# EAGLE schematic 68030-TK-V09f (EAGLE 6.6.0)

## Sheet 1 of 3
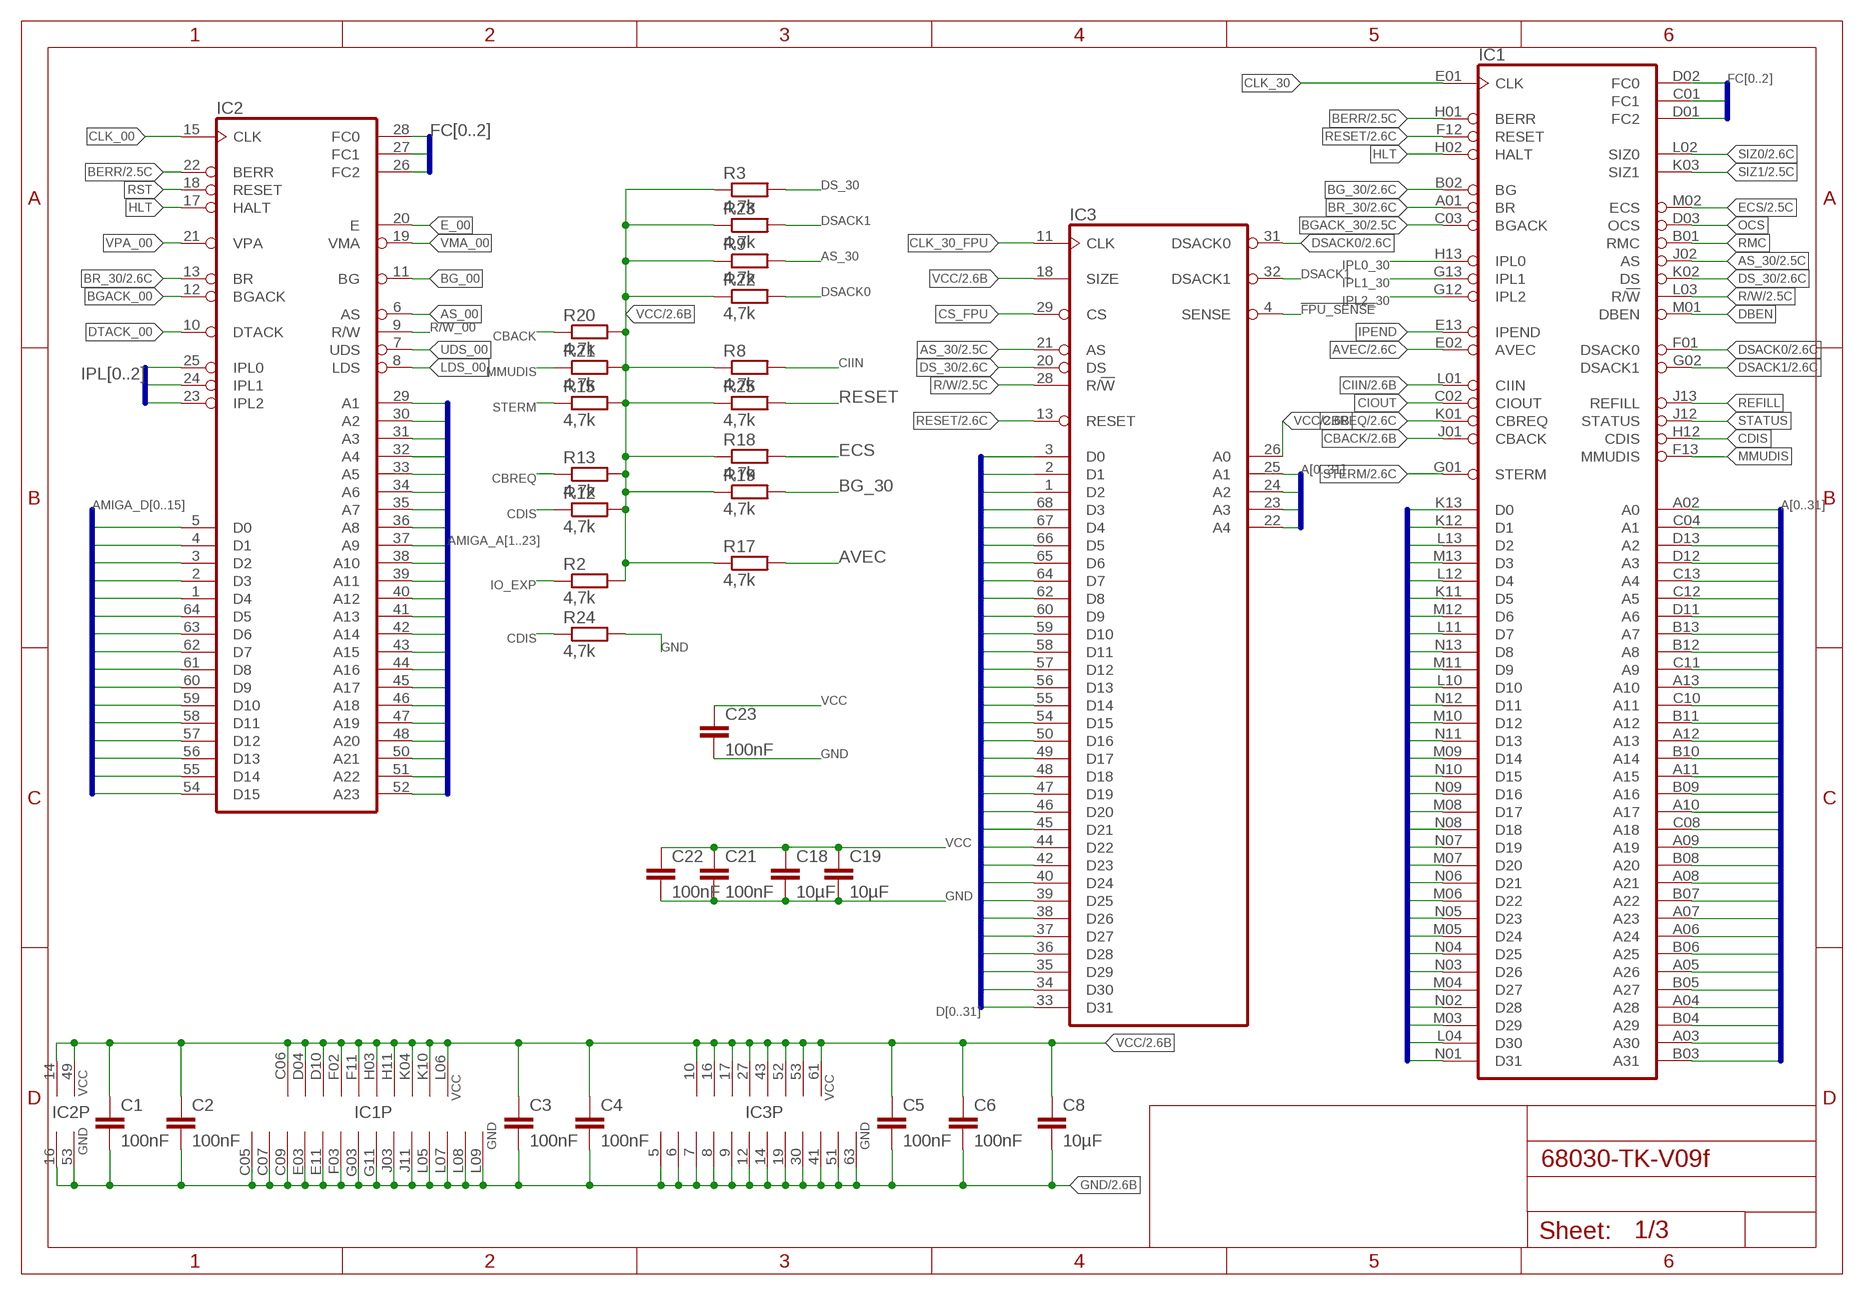
[diagram p0: schematic, sheet 1]

### Parts
C1  100nF  C-EUC0603K  [C0603K]
C2  100nF  C-EUC0603K  [C0603K]
C3  100nF  C-EUC0603K  [C0603K]
C4  100nF  C-EUC0603K  [C0603K]
C5  100nF  C-EUC0603K  [C0603K]
C6  100nF  C-EUC0603K  [C0603K]
C8  10µF  C-EUC1210  [C1210]
C18  10µF  C-EUC1210  [C1210]
C19  10µF  C-EUC1210  [C1210]
C21  100nF  C-EUC0603K  [C0603K]
C22  100nF  C-EUC0603K  [C0603K]
C23  100nF  C-EUC0603K  [C0603K]
IC1  MC68030RC  [MPGA128]
IC2  MC68000P  [DIL64]
IC3  MC68881FN  [PLCC68]
R2  4,7k  R-EU_R0603  [R0603]
R3  4,7k  R-EU_R0603  [R0603]
R8  4,7k  R-EU_R0603  [R0603]
R9  4,7k  R-EU_R0603  [R0603]
R12  4,7k  R-EU_R0603  [R0603]
R13  4,7k  R-EU_R0603  [R0603]
R15  4,7k  R-EU_R0603  [R0603]
R17  4,7k  R-EU_R0603  [R0603]
R18  4,7k  R-EU_R0603  [R0603]
R19  4,7k  R-EU_R0603  [R0603]
R20  4,7k  R-EU_R0603  [R0603]
R21  4,7k  R-EU_R0603  [R0603]
R22  4,7k  R-EU_R0603  [R0603]
R23  4,7k  R-EU_R0603  [R0603]
R24  4,7k  R-EU_R0603  [R0603]
R25  4,7k  R-EU_R0603  [R0603]

### Nets
!FPU_SENSE: IC3.4(SENSE) ; also sheet 2
A0: IC1.A02(A0) ; also sheet 2,3
A1: IC1.C04(A1) IC3.25(A1) ; also sheet 2,3
A2: IC1.D13(A2) IC3.24(A2) ; also sheet 2,3
A3: IC1.D12(A3) IC3.23(A3) ; also sheet 2,3
A4: IC1.C13(A4) IC3.22(A4) ; also sheet 2,3
A5: IC1.C12(A5) ; also sheet 2,3
A6: IC1.D11(A6) ; also sheet 2,3
A7: IC1.B13(A7) ; also sheet 2,3
A8: IC1.B12(A8) ; also sheet 2,3
A9: IC1.C11(A9) ; also sheet 2,3
A10: IC1.A13(A10) ; also sheet 2,3
A11: IC1.C10(A11) ; also sheet 2,3
A12: IC1.B11(A12) ; also sheet 2,3
A13: IC1.A12(A13) ; also sheet 2,3
A14: IC1.B10(A14) ; also sheet 2,3
A15: IC1.A11(A15) ; also sheet 2,3
A16: IC1.B09(A16) ; also sheet 2,3
A17: IC1.A10(A17) ; also sheet 2,3
A18: IC1.C08(A18) ; also sheet 2,3
A19: IC1.A09(A19) ; also sheet 2,3
A20: IC1.B08(A20) ; also sheet 2,3
A21: IC1.A08(A21) ; also sheet 2,3
A22: IC1.B07(A22) ; also sheet 2,3
A23: IC1.A07(A23) ; also sheet 2,3
A24: IC1.A06(A24) ; also sheet 2,3
A25: IC1.B06(A25) ; also sheet 2,3
A26: IC1.A05(A26) ; also sheet 2,3
A27: IC1.B05(A27) ; also sheet 2,3
A28: IC1.A04(A28) ; also sheet 2,3
A29: IC1.B04(A29) ; also sheet 2,3
A30: IC1.A03(A30) ; also sheet 2,3
A31: IC1.B03(A31) ; also sheet 2,3
AMIGA_A1: IC2.29(A1) ; also sheet 3
AMIGA_A2: IC2.30(A2) ; also sheet 3
AMIGA_A3: IC2.31(A3) ; also sheet 3
AMIGA_A4: IC2.32(A4) ; also sheet 3
AMIGA_A5: IC2.33(A5) ; also sheet 3
AMIGA_A6: IC2.34(A6) ; also sheet 3
AMIGA_A7: IC2.35(A7) ; also sheet 3
AMIGA_A8: IC2.36(A8) ; also sheet 3
AMIGA_A9: IC2.37(A9) ; also sheet 3
AMIGA_A10: IC2.38(A10) ; also sheet 3
AMIGA_A11: IC2.39(A11) ; also sheet 3
AMIGA_A12: IC2.40(A12) ; also sheet 3
AMIGA_A13: IC2.41(A13) ; also sheet 3
AMIGA_A14: IC2.42(A14) ; also sheet 3
AMIGA_A15: IC2.43(A15) ; also sheet 3
AMIGA_A16: IC2.44(A16) ; also sheet 3
AMIGA_A17: IC2.45(A17) ; also sheet 3
AMIGA_A18: IC2.46(A18) ; also sheet 3
AMIGA_A19: IC2.47(A19) ; also sheet 3
AMIGA_A20: IC2.48(A20) ; also sheet 3
AMIGA_A21: IC2.50(A21) ; also sheet 3
AMIGA_A22: IC2.51(A22) ; also sheet 3
AMIGA_A23: IC2.52(A23) ; also sheet 3
AMIGA_D0: IC2.5(D0) ; also sheet 3
AMIGA_D1: IC2.4(D1) ; also sheet 3
AMIGA_D2: IC2.3(D2) ; also sheet 3
AMIGA_D3: IC2.2(D3) ; also sheet 3
AMIGA_D4: IC2.1(D4) ; also sheet 3
AMIGA_D5: IC2.64(D5) ; also sheet 3
AMIGA_D6: IC2.63(D6) ; also sheet 3
AMIGA_D7: IC2.62(D7) ; also sheet 3
AMIGA_D8: IC2.61(D8) ; also sheet 3
AMIGA_D9: IC2.60(D9) ; also sheet 3
AMIGA_D10: IC2.59(D10) ; also sheet 3
AMIGA_D11: IC2.58(D11) ; also sheet 3
AMIGA_D12: IC2.57(D12) ; also sheet 3
AMIGA_D13: IC2.56(D13) ; also sheet 3
AMIGA_D14: IC2.55(D14) ; also sheet 3
AMIGA_D15: IC2.54(D15) ; also sheet 3
AS_00: IC2.6(AS) ; also sheet 2
AS_30: IC1.J02(AS) IC3.21(AS) R9.2 ; also sheet 2
AVEC: IC1.E02(AVEC) R17.2 ; also sheet 2
BERR: IC1.H01(BERR) IC2.22(BERR) ; also sheet 2
BG_00: IC2.11(BG) ; also sheet 2
BG_30: IC1.B02(BG) R19.2 ; also sheet 2
BGACK_00: IC2.12(BGACK) ; also sheet 2,3
BGACK_30: IC1.C03(BGACK) ; also sheet 2
BR_30: IC1.A01(BR) IC2.13(BR) ; also sheet 2
CBACK: IC1.J01(CBACK) R20.1 ; also sheet 2
CBREQ: IC1.K01(CBREQ) R13.1 ; also sheet 2
CDIS: IC1.H12(CDIS) R12.1 R24.1
CIIN: IC1.L01(CIIN) R8.2 ; also sheet 2
CIOUT: IC1.C02(CIOUT)
CLK_00: IC2.15(CLK) ; also sheet 2
CLK_30: IC1.E01(CLK) ; also sheet 2
CLK_30_FPU: IC3.11(CLK) ; also sheet 2
CS_FPU: IC3.29(CS) ; also sheet 2
D0: IC1.K13(D0) IC3.3(D0) ; also sheet 2,3
D1: IC1.K12(D1) IC3.2(D1) ; also sheet 2,3
D2: IC1.L13(D2) IC3.1(D2) ; also sheet 2,3
D3: IC1.M13(D3) IC3.68(D3) ; also sheet 2,3
D4: IC1.L12(D4) IC3.67(D4) ; also sheet 2,3
D5: IC1.K11(D5) IC3.66(D5) ; also sheet 2,3
D6: IC1.M12(D6) IC3.65(D6) ; also sheet 2,3
D7: IC1.L11(D7) IC3.64(D7) ; also sheet 2,3
D8: IC1.N13(D8) IC3.62(D8) ; also sheet 2,3
D9: IC1.M11(D9) IC3.60(D9) ; also sheet 2,3
D10: IC1.L10(D10) IC3.59(D10) ; also sheet 2,3
D11: IC1.N12(D11) IC3.58(D11) ; also sheet 2,3
D12: IC1.M10(D12) IC3.57(D12) ; also sheet 2,3
D13: IC1.N11(D13) IC3.56(D13) ; also sheet 2,3
D14: IC1.M09(D14) IC3.55(D14) ; also sheet 2,3
D15: IC1.N10(D15) IC3.54(D15) ; also sheet 2,3
D16: IC1.N09(D16) IC3.50(D16) ; also sheet 2,3
D17: IC1.M08(D17) IC3.49(D17) ; also sheet 2,3
D18: IC1.N08(D18) IC3.48(D18) ; also sheet 2,3
D19: IC1.N07(D19) IC3.47(D19) ; also sheet 2,3
D20: IC1.M07(D20) IC3.46(D20) ; also sheet 2,3
D21: IC1.N06(D21) IC3.45(D21) ; also sheet 2,3
D22: IC1.M06(D22) IC3.44(D22) ; also sheet 2,3
D23: IC1.N05(D23) IC3.42(D23) ; also sheet 2,3
D24: IC1.M05(D24) IC3.40(D24) ; also sheet 2,3
D25: IC1.N04(D25) IC3.39(D25) ; also sheet 2,3
D26: IC1.N03(D26) IC3.38(D26) ; also sheet 2,3
D27: IC1.M04(D27) IC3.37(D27) ; also sheet 2,3
D28: IC1.N02(D28) IC3.36(D28) ; also sheet 2,3
D29: IC1.M03(D29) IC3.35(D29) ; also sheet 2,3
D30: IC1.L04(D30) IC3.34(D30) ; also sheet 2,3
D31: IC1.N01(D31) IC3.33(D31) ; also sheet 2,3
DBEN: IC1.M01(DBEN)
DS_30: IC1.K02(DS) IC3.20(DS) R3.2 ; also sheet 2
DSACK0: IC1.F01(DSACK0) IC3.31(DSACK0) R22.2 ; also sheet 2
DSACK1: IC1.G02(DSACK1) IC3.32(DSACK1) R23.2 ; also sheet 2
DTACK_00: IC2.10(DTACK) ; also sheet 2
E_00: IC2.20(E) ; also sheet 2
ECS: IC1.M02(ECS) R18.2 ; also sheet 2
FC0: IC1.D02(FC0) IC2.28(FC0) ; also sheet 2
FC1: IC1.C01(FC1) IC2.27(FC1) ; also sheet 2
FC2: IC1.D01(FC2) IC2.26(FC2) ; also sheet 2
GND: C1.2 C2.2 C3.2 C4.2 C5.2 C6.2 C8.2 C18.2 C19.2 C21.2 C22.2 C23.2 IC1.C05(GND) IC1.C07(GND) IC1.C09(GND) IC1.E03(GND) IC1.E11(GND) IC1.F03(GND) IC1.G03(GND) IC1.G11(GND) IC1.J03(GND) IC1.J11(GND) IC1.L05(GND) IC1.L07(GND) IC1.L08(GND) IC1.L09(GND) IC2.16(GND) IC2.53(GND) IC3.5(GND) IC3.6(GND) IC3.7(GND) IC3.8(GND) IC3.9(GND) IC3.12(GND) IC3.14(GND) IC3.19(GND) IC3.30(GND) IC3.41(GND) IC3.51(GND) IC3.63(GND) R24.2 ; also sheet 2,3
HLT: IC1.H02(HALT) IC2.17(HALT)
IO_EXP: R2.1 ; also sheet 2
IPEND: IC1.E13(IPEND)
IPL0: IC2.25(IPL0) ; also sheet 2
IPL0_30: IC1.H13(IPL0) ; also sheet 2
IPL1: IC2.24(IPL1) ; also sheet 2
IPL1_30: IC1.G13(IPL1) ; also sheet 2
IPL2: IC2.23(IPL2) ; also sheet 2
IPL2_30: IC1.G12(IPL2) ; also sheet 2
LDS_00: IC2.8(LDS) ; also sheet 2
MMUDIS: IC1.F13(MMUDIS) R21.1
OCS: IC1.D03(OCS)
R/W: IC1.L03(R/!W) IC3.28(R/!W) ; also sheet 2
R/W_00: IC2.9(R/W) ; also sheet 2
REFILL: IC1.J13(REFILL)
RESET: IC1.F12(RESET) IC3.13(RESET) R25.2 ; also sheet 2
RMC: IC1.B01(RMC)
RST: IC2.18(RESET) ; also sheet 2
SIZ0: IC1.L02(SIZ0) ; also sheet 2
SIZ1: IC1.K03(SIZ1) ; also sheet 2
STATUS: IC1.J12(STATUS)
STERM: IC1.G01(STERM) R15.1 ; also sheet 2
UDS_00: IC2.7(UDS) ; also sheet 2
VCC: C1.1 C2.1 C3.1 C4.1 C5.1 C6.1 C8.1 C18.1 C19.1 C21.1 C22.1 C23.1 IC1.C06(VCC) IC1.D04(VCC) IC1.D10(VCC) IC1.F02(VCC) IC1.F11(VCC) IC1.H03(VCC) IC1.H11(VCC) IC1.K04(VCC) IC1.K10(VCC) IC1.L06(VCC) IC2.14(VCC) IC2.49(VCC) IC3.10(VCC) IC3.16(VCC) IC3.17(VCC) IC3.18(SIZE) IC3.26(A0) IC3.27(VCC) IC3.43(VCC) IC3.52(VCC) IC3.53(VCC) IC3.61(VCC) R2.2 R3.1 R8.1 R9.1 R12.2 R13.2 R15.2 R17.1 R18.1 R19.1 R20.2 R21.2 R22.1 R23.1 R25.1 ; also sheet 2,3
VMA_00: IC2.19(VMA) ; also sheet 2
VPA_00: IC2.21(VPA) ; also sheet 2

### Buses
A[0..31]
FC[0..2]
IPL[0..2]
D[0..31]
AMIGA_A[1..23]
AMIGA_D[0..15]

## Sheet 2 of 3
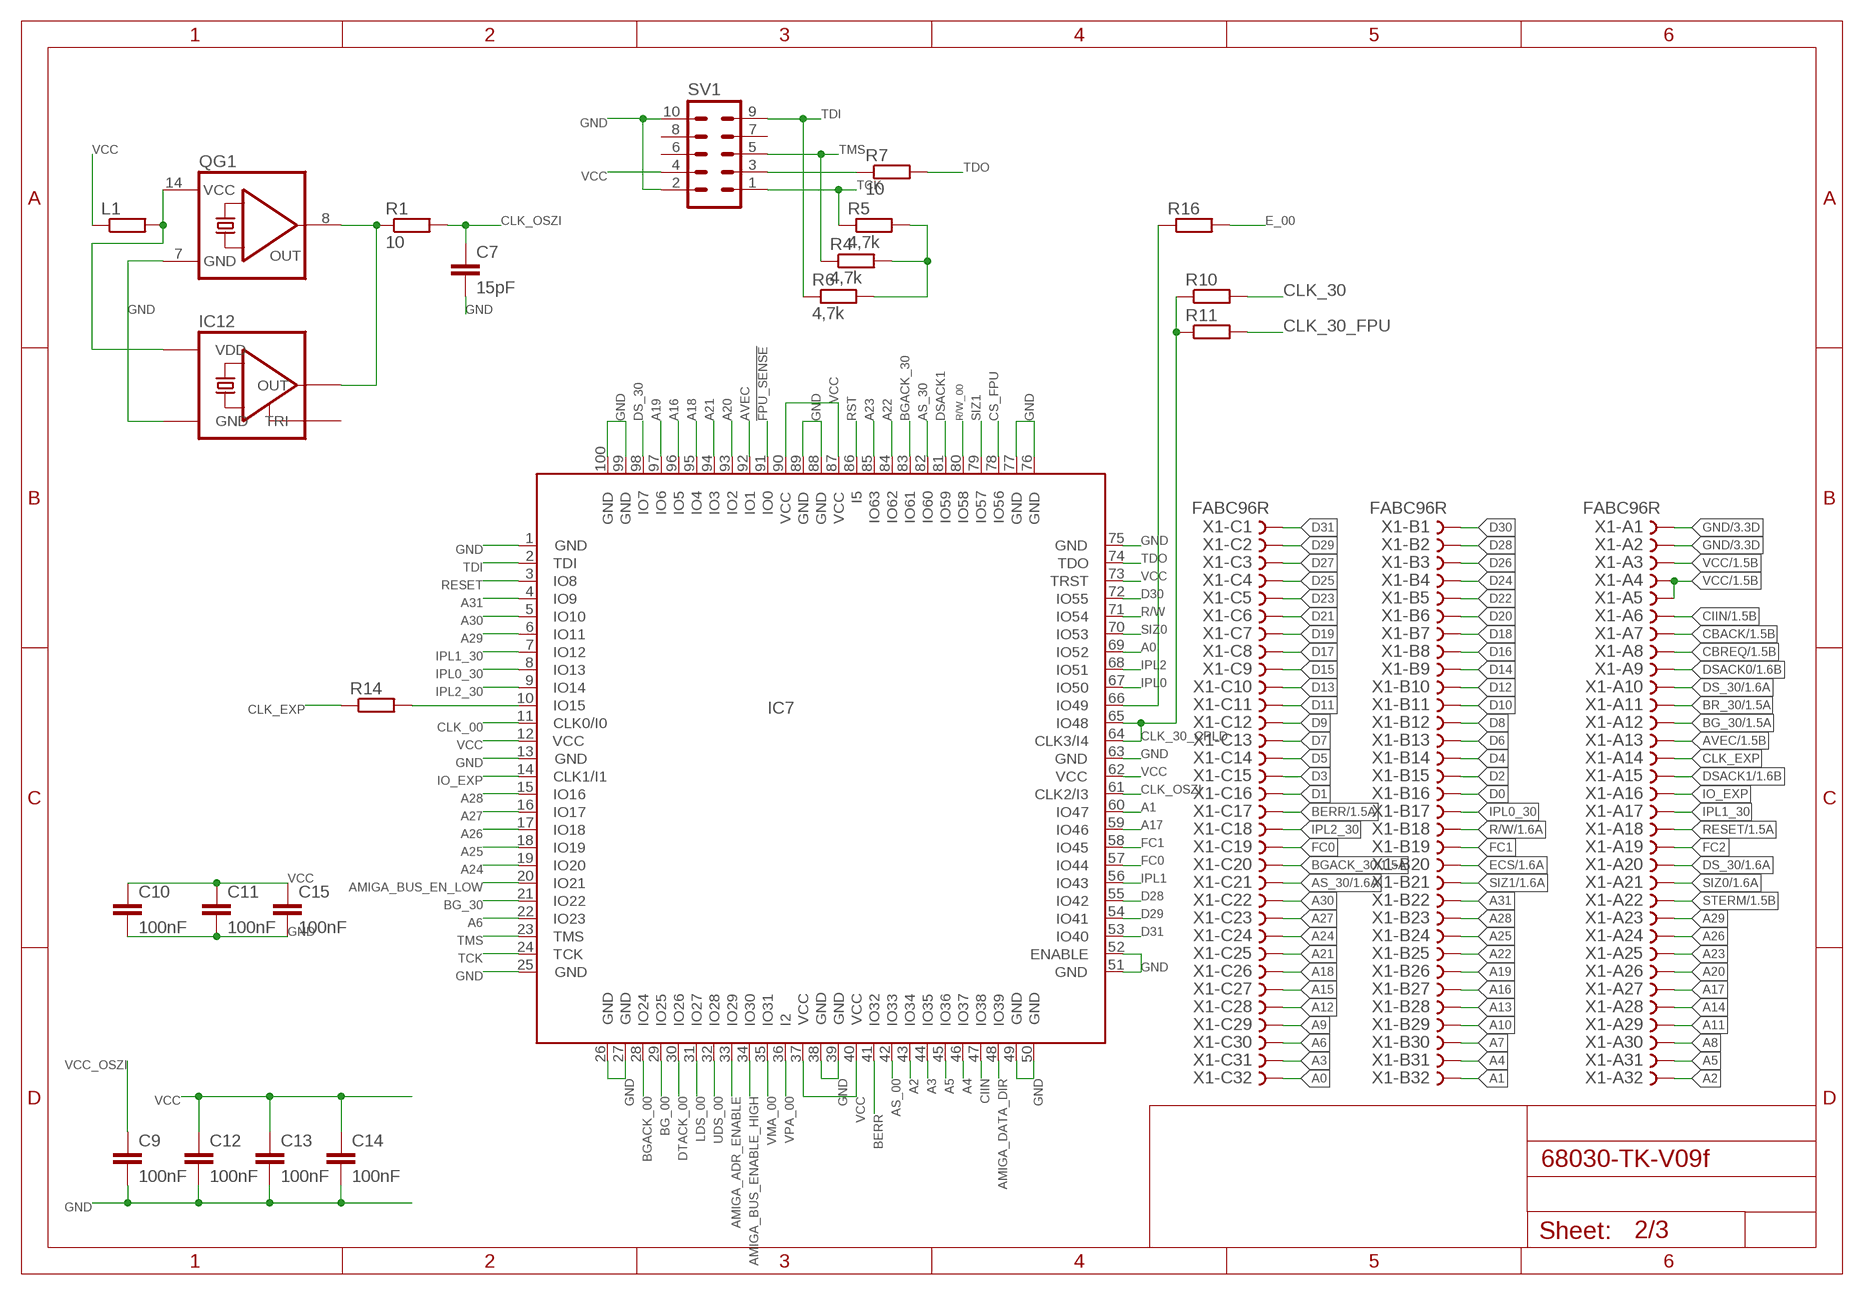
[diagram p1: schematic, sheet 2]

### Parts
C7  15pF  C-EUC0805K  [C0805K]
C9  100nF  C-EUC0603K  [C0603K]
C10  100nF  C-EUC0603K  [C0603K]
C11  100nF  C-EUC0603K  [C0603K]
C12  100nF  C-EUC0603K  [C0603K]
C13  100nF  C-EUC0603K  [C0603K]
C14  100nF  C-EUC0603K  [C0603K]
C15  100nF  C-EUC0603K  [C0603K]
IC7  M4-128T100  [TQFP100]
IC12  CSX-750FCFC(5V)  [7X5]
L1  R-EU_R0805  [R0805]
QG1  QG5860  [DIL14S]
R1  10  R-EU_R0805  [R0805]
R4  4,7k  R-EU_R0603  [R0603]
R5  4,7k  R-EU_R0603  [R0603]
R6  4,7k  R-EU_R0603  [R0603]
R7  10  R-EU_R0603  [R0603]
R10  R-EU_R0603  [R0603]
R11  R-EU_R0603  [R0603]
R14  R-EU_R0603  [R0603]
R16  R-EU_R0603  [R0603]
SV1  ML10  [ML10]
X1  FABC96R  [FABC96R]

### Nets
!FPU_SENSE: IC7.91(IO0) ; also sheet 1
A0: IC7.69(IO52) X1.C32 ; also sheet 1,3
A1: IC7.60(IO47) X1.B32 ; also sheet 1,3
A2: IC7.43(IO34) X1.A32 ; also sheet 1,3
A3: IC7.44(IO35) X1.C31 ; also sheet 1,3
A4: IC7.46(IO37) X1.B31 ; also sheet 1,3
A5: IC7.45(IO36) X1.A31 ; also sheet 1,3
A6: IC7.22(IO23) X1.C30 ; also sheet 1,3
A7: X1.B30 ; also sheet 1,3
A8: X1.A30 ; also sheet 1,3
A9: X1.C29 ; also sheet 1,3
A10: X1.B29 ; also sheet 1,3
A11: X1.A29 ; also sheet 1,3
A12: X1.C28 ; also sheet 1,3
A13: X1.B28 ; also sheet 1,3
A14: X1.A28 ; also sheet 1,3
A15: X1.C27 ; also sheet 1,3
A16: IC7.96(IO5) X1.B27 ; also sheet 1,3
A17: IC7.59(IO46) X1.A27 ; also sheet 1,3
A18: IC7.95(IO4) X1.C26 ; also sheet 1,3
A19: IC7.97(IO6) X1.B26 ; also sheet 1,3
A20: IC7.93(IO2) X1.A26 ; also sheet 1,3
A21: IC7.94(IO3) X1.C25 ; also sheet 1,3
A22: IC7.84(IO62) X1.B25 ; also sheet 1,3
A23: IC7.85(IO63) X1.A25 ; also sheet 1,3
A24: IC7.19(IO20) X1.C24 ; also sheet 1,3
A25: IC7.18(IO19) X1.B24 ; also sheet 1,3
A26: IC7.17(IO18) X1.A24 ; also sheet 1,3
A27: IC7.16(IO17) X1.C23 ; also sheet 1,3
A28: IC7.15(IO16) X1.B23 ; also sheet 1,3
A29: IC7.6(IO11) X1.A23 ; also sheet 1,3
A30: IC7.5(IO10) X1.C22 ; also sheet 1,3
A31: IC7.4(IO9) X1.B22 ; also sheet 1,3
AMIGA_ADR_ENABLE: IC7.33(IO29) ; also sheet 3
AMIGA_BUS_EN_LOW: IC7.20(IO21) ; also sheet 3
AMIGA_BUS_ENABLE_HIGH: IC7.34(IO30) ; also sheet 3
AMIGA_DATA_DIR: IC7.48(IO39) ; also sheet 3
AS_00: IC7.42(IO33) ; also sheet 1
AS_30: IC7.82(IO60) X1.C21 ; also sheet 1
AVEC: IC7.92(IO1) X1.A13 ; also sheet 1
BERR: IC7.41(IO32) X1.C17 ; also sheet 1
BG_00: IC7.29(IO25) ; also sheet 1
BG_30: IC7.21(IO22) X1.A12 ; also sheet 1
BGACK_00: IC7.28(IO24) ; also sheet 1,3
BGACK_30: IC7.83(IO61) X1.C20 ; also sheet 1
BR_30: X1.A11 ; also sheet 1
CBACK: X1.A7 ; also sheet 1
CBREQ: X1.A8 ; also sheet 1
CIIN: IC7.47(IO38) X1.A6 ; also sheet 1
CLK_00: IC7.11(CLK0/I0) ; also sheet 1
CLK_30: R10.2 ; also sheet 1
CLK_30_CPLD: IC7.64(CLK3/I4) IC7.65(IO48) R10.1 R11.1
CLK_30_FPU: R11.2 ; also sheet 1
CLK_EXP: R14.1 X1.A14
CLK_OSZI: C7.1 IC7.61(CLK2/I3) R1.2
CS_FPU: IC7.78(IO56) ; also sheet 1
D0: X1.B16 ; also sheet 1,3
D1: X1.C16 ; also sheet 1,3
D2: X1.B15 ; also sheet 1,3
D3: X1.C15 ; also sheet 1,3
D4: X1.B14 ; also sheet 1,3
D5: X1.C14 ; also sheet 1,3
D6: X1.B13 ; also sheet 1,3
D7: X1.C13 ; also sheet 1,3
D8: X1.B12 ; also sheet 1,3
D9: X1.C12 ; also sheet 1,3
D10: X1.B11 ; also sheet 1,3
D11: X1.C11 ; also sheet 1,3
D12: X1.B10 ; also sheet 1,3
D13: X1.C10 ; also sheet 1,3
D14: X1.B9 ; also sheet 1,3
D15: X1.C9 ; also sheet 1,3
D16: X1.B8 ; also sheet 1,3
D17: X1.C8 ; also sheet 1,3
D18: X1.B7 ; also sheet 1,3
D19: X1.C7 ; also sheet 1,3
D20: X1.B6 ; also sheet 1,3
D21: X1.C6 ; also sheet 1,3
D22: X1.B5 ; also sheet 1,3
D23: X1.C5 ; also sheet 1,3
D24: X1.B4 ; also sheet 1,3
D25: X1.C4 ; also sheet 1,3
D26: X1.B3 ; also sheet 1,3
D27: X1.C3 ; also sheet 1,3
D28: IC7.55(IO42) X1.B2 ; also sheet 1,3
D29: IC7.54(IO41) X1.C2 ; also sheet 1,3
D30: IC7.72(IO55) X1.B1 ; also sheet 1,3
D31: IC7.53(IO40) X1.C1 ; also sheet 1,3
DS_30: IC7.98(IO7) X1.A10 X1.A20 ; also sheet 1
DSACK0: X1.A9 ; also sheet 1
DSACK1: IC7.81(IO59) X1.A15 ; also sheet 1
DTACK_00: IC7.30(IO26) ; also sheet 1
E_00: R16.2 ; also sheet 1
ECS: X1.B20 ; also sheet 1
FC0: IC7.57(IO44) X1.C19 ; also sheet 1
FC1: IC7.58(IO45) X1.B19 ; also sheet 1
FC2: X1.A19 ; also sheet 1
GND: C7.2 C9.2 C10.2 C11.2 C12.2 C13.2 C14.2 C15.2 IC7.1(GND) IC7.13(GND) IC7.25(GND) IC7.26(GND) IC7.27(GND) IC7.38(GND) IC7.39(GND) IC7.49(GND) IC7.50(GND) IC7.51(GND) IC7.52(ENABLE) IC7.63(GND) IC7.75(GND) IC7.76(GND) IC7.77(GND) IC7.88(GND) IC7.89(GND) IC7.99(GND) IC7.100(GND) IC12.P$2(GND) QG1.7(GND) SV1.2 SV1.10 X1.A1 X1.A2 ; also sheet 1,3
IO_EXP: IC7.14(CLK1/I1) X1.A16 ; also sheet 1
IPL0: IC7.67(IO50) ; also sheet 1
IPL0_30: IC7.8(IO13) X1.B17 ; also sheet 1
IPL1: IC7.56(IO43) ; also sheet 1
IPL1_30: IC7.7(IO12) X1.A17 ; also sheet 1
IPL2: IC7.68(IO51) ; also sheet 1
IPL2_30: IC7.9(IO14) X1.C18 ; also sheet 1
LDS_00: IC7.31(IO27) ; also sheet 1
N$1: IC7.10(IO15) R14.2
N$2: IC7.66(IO49) R16.1
OSZI_OUT: IC12.P$3(OUT) QG1.8(OUT) R1.1
R/W: IC7.71(IO54) X1.B18 ; also sheet 1
R/W_00: IC7.80(IO58) ; also sheet 1
RESET: IC7.3(IO8) X1.A18 ; also sheet 1
RST: IC7.86(I5) ; also sheet 1
SIZ0: IC7.70(IO53) X1.A21 ; also sheet 1
SIZ1: IC7.79(IO57) X1.B21 ; also sheet 1
STERM: X1.A22 ; also sheet 1
TCK: IC7.24(TCK) R5.1 SV1.1
TDI: IC7.2(TDI) R6.1 SV1.9
TDO: IC7.74(TDO) R7.2
TDO-PIN: R7.1 SV1.3
TMS: IC7.23(TMS) R4.1 SV1.5
UDS_00: IC7.32(IO28) ; also sheet 1
VCC: C10.1 C11.1 C12.1 C13.1 C14.1 C15.1 IC7.12(VCC) IC7.37(VCC) IC7.40(VCC) IC7.62(VCC) IC7.73(TRST) IC7.87(VCC) IC7.90(VCC) L1.1 R4.2 R5.2 R6.2 SV1.4 X1.A3 X1.A4 X1.A5 ; also sheet 1,3
VCC_OSZI: C9.1 IC12.P$4(VDD) L1.2 QG1.14(VCC)
VMA_00: IC7.35(IO31) ; also sheet 1
VPA_00: IC7.36(I2) ; also sheet 1
Unconnected: IC12.P$1(TRI) SV1.6 SV1.7 SV1.8

## Sheet 3 of 3
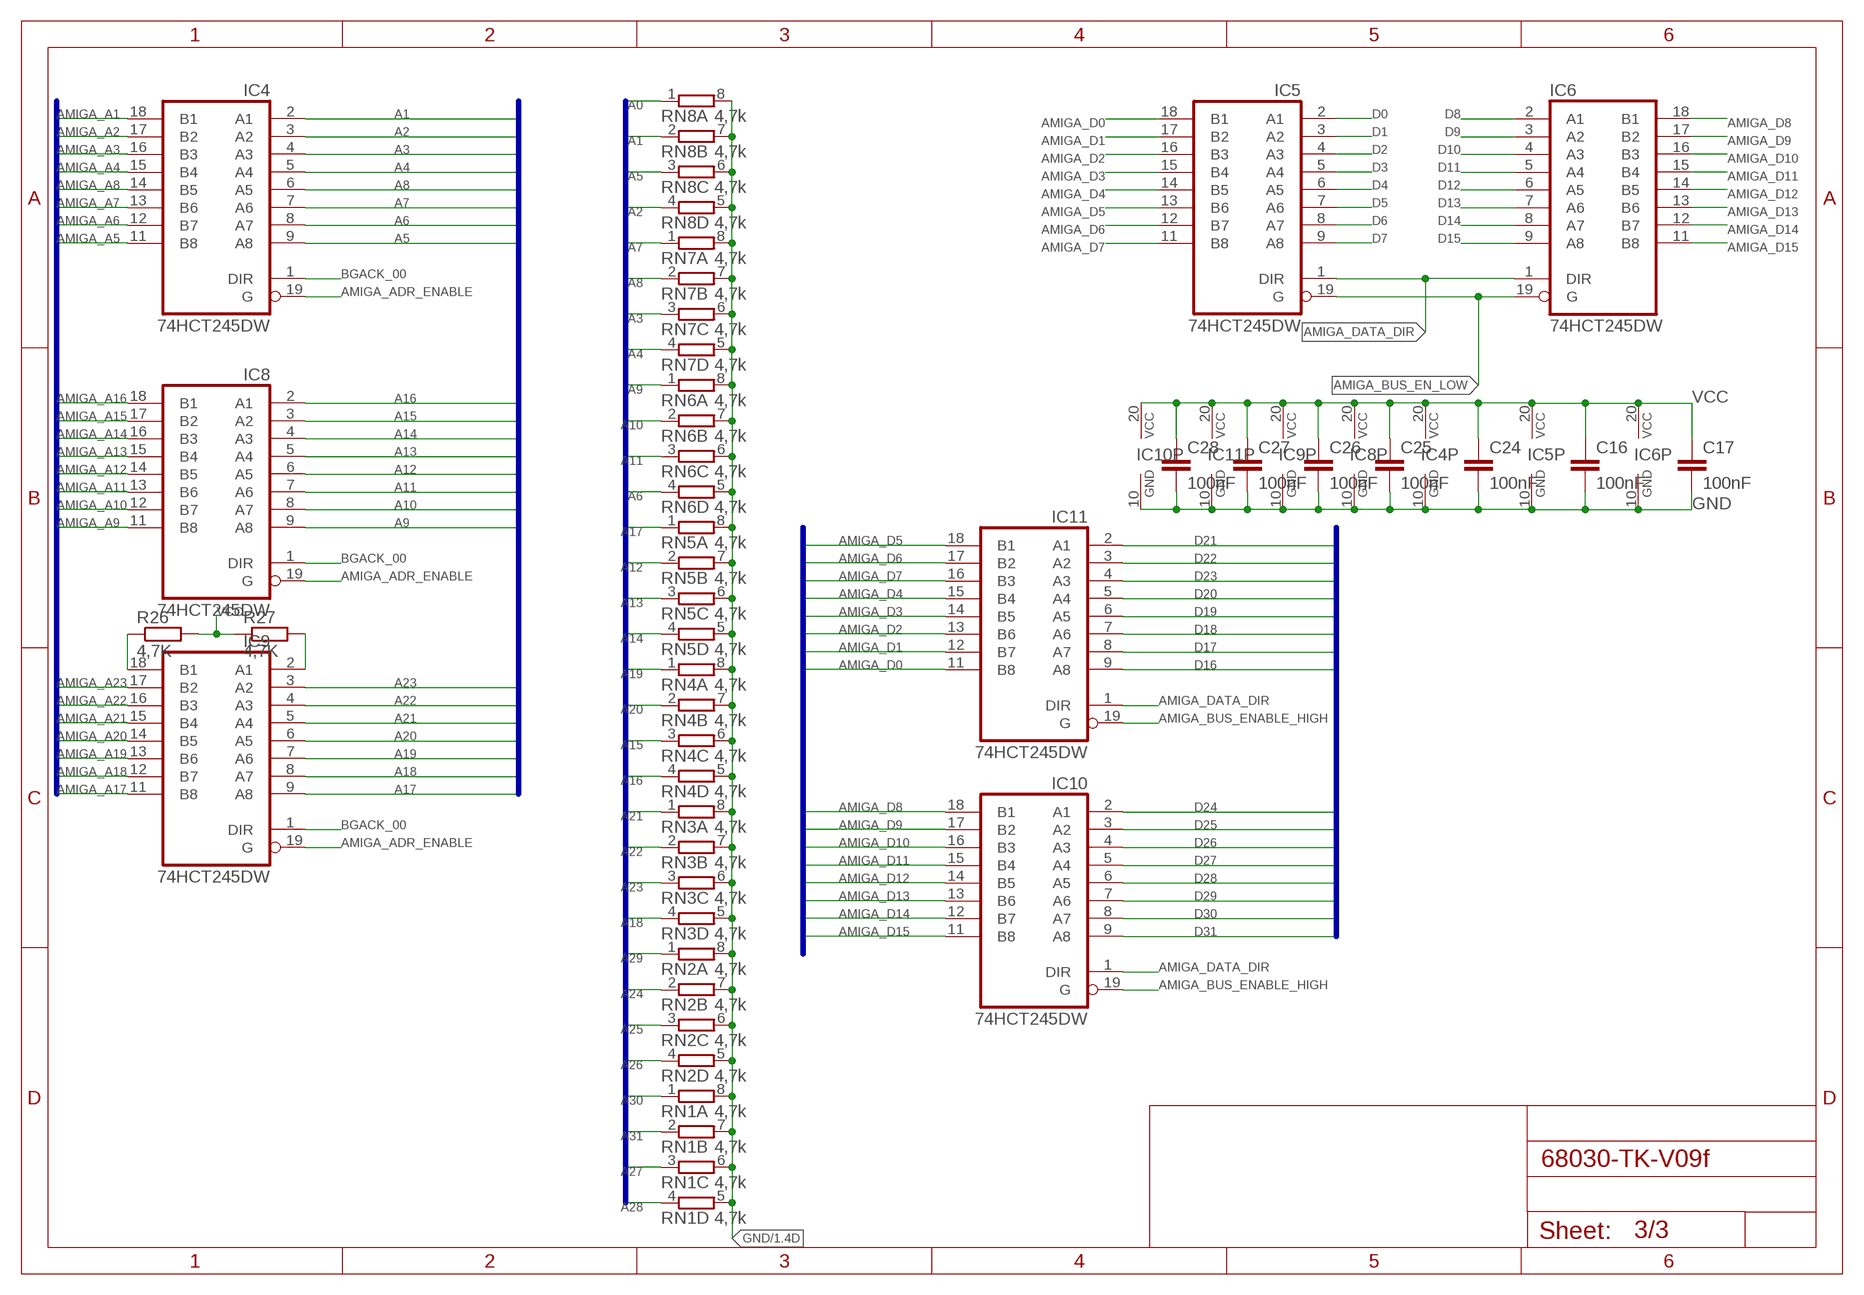
[diagram p2: schematic, sheet 3]

### Parts
C16  100nF  C-EUC0603K  [C0603K]
C17  100nF  C-EUC0603K  [C0603K]
C24  100nF  C-EUC0603K  [C0603K]
C25  100nF  C-EUC0603K  [C0603K]
C26  100nF  C-EUC0603K  [C0603K]
C27  100nF  C-EUC0603K  [C0603K]
C28  100nF  C-EUC0603K  [C0603K]
IC4  74HCT245DW  [SO20W]
IC5  74HCT245DW  [SO20W]
IC6  74HCT245DW  [SO20W]
IC8  74HCT245DW  [SO20W]
IC9  74HCT245DW  [SO20W]
IC10  74HCT245DW  [SO20W]
IC11  74HCT245DW  [SO20W]
R26  4,7K  R-EU_R0603  [R0603]
R27  4,7K  R-EU_R0603  [R0603]
RN1  4,7k  4R-NEXBV8V  [EXBV8V]
RN2  4,7k  4R-NEXBV8V  [EXBV8V]
RN3  4,7k  4R-NEXBV8V  [EXBV8V]
RN4  4,7k  4R-NEXBV8V  [EXBV8V]
RN5  4,7k  4R-NEXBV8V  [EXBV8V]
RN6  4,7k  4R-NEXBV8V  [EXBV8V]
RN7  4,7k  4R-NEXBV8V  [EXBV8V]
RN8  4,7k  4R-NEXBV8V  [EXBV8V]

### Nets
A0: RN8.1 ; also sheet 1,2
A1: IC4.2(A1) RN8.2 ; also sheet 1,2
A2: IC4.3(A2) RN8.4 ; also sheet 1,2
A3: IC4.4(A3) RN7.3 ; also sheet 1,2
A4: IC4.5(A4) RN7.4 ; also sheet 1,2
A5: IC4.9(A8) RN8.3 ; also sheet 1,2
A6: IC4.8(A7) RN6.4 ; also sheet 1,2
A7: IC4.7(A6) RN7.1 ; also sheet 1,2
A8: IC4.6(A5) RN7.2 ; also sheet 1,2
A9: IC8.9(A8) RN6.1 ; also sheet 1,2
A10: IC8.8(A7) RN6.2 ; also sheet 1,2
A11: IC8.7(A6) RN6.3 ; also sheet 1,2
A12: IC8.6(A5) RN5.2 ; also sheet 1,2
A13: IC8.5(A4) RN5.3 ; also sheet 1,2
A14: IC8.4(A3) RN5.4 ; also sheet 1,2
A15: IC8.3(A2) RN4.3 ; also sheet 1,2
A16: IC8.2(A1) RN4.4 ; also sheet 1,2
A17: IC9.9(A8) RN5.1 ; also sheet 1,2
A18: IC9.8(A7) RN3.4 ; also sheet 1,2
A19: IC9.7(A6) RN4.1 ; also sheet 1,2
A20: IC9.6(A5) RN4.2 ; also sheet 1,2
A21: IC9.5(A4) RN3.1 ; also sheet 1,2
A22: IC9.4(A3) RN3.2 ; also sheet 1,2
A23: IC9.3(A2) RN3.3 ; also sheet 1,2
A24: RN2.2 ; also sheet 1,2
A25: RN2.3 ; also sheet 1,2
A26: RN2.4 ; also sheet 1,2
A27: RN1.3 ; also sheet 1,2
A28: RN1.4 ; also sheet 1,2
A29: RN2.1 ; also sheet 1,2
A30: RN1.1 ; also sheet 1,2
A31: RN1.2 ; also sheet 1,2
AMIGA_A1: IC4.18(B1) ; also sheet 1
AMIGA_A2: IC4.17(B2) ; also sheet 1
AMIGA_A3: IC4.16(B3) ; also sheet 1
AMIGA_A4: IC4.15(B4) ; also sheet 1
AMIGA_A5: IC4.11(B8) ; also sheet 1
AMIGA_A6: IC4.12(B7) ; also sheet 1
AMIGA_A7: IC4.13(B6) ; also sheet 1
AMIGA_A8: IC4.14(B5) ; also sheet 1
AMIGA_A9: IC8.11(B8) ; also sheet 1
AMIGA_A10: IC8.12(B7) ; also sheet 1
AMIGA_A11: IC8.13(B6) ; also sheet 1
AMIGA_A12: IC8.14(B5) ; also sheet 1
AMIGA_A13: IC8.15(B4) ; also sheet 1
AMIGA_A14: IC8.16(B3) ; also sheet 1
AMIGA_A15: IC8.17(B2) ; also sheet 1
AMIGA_A16: IC8.18(B1) ; also sheet 1
AMIGA_A17: IC9.11(B8) ; also sheet 1
AMIGA_A18: IC9.12(B7) ; also sheet 1
AMIGA_A19: IC9.13(B6) ; also sheet 1
AMIGA_A20: IC9.14(B5) ; also sheet 1
AMIGA_A21: IC9.15(B4) ; also sheet 1
AMIGA_A22: IC9.16(B3) ; also sheet 1
AMIGA_A23: IC9.17(B2) ; also sheet 1
AMIGA_ADR_ENABLE: IC4.19(G) IC8.19(G) IC9.19(G) ; also sheet 2
AMIGA_BUS_EN_LOW: IC5.19(G) IC6.19(G) ; also sheet 2
AMIGA_BUS_ENABLE_HIGH: IC10.19(G) IC11.19(G) ; also sheet 2
AMIGA_D0: IC5.18(B1) IC11.11(B8) ; also sheet 1
AMIGA_D1: IC5.17(B2) IC11.12(B7) ; also sheet 1
AMIGA_D2: IC5.16(B3) IC11.13(B6) ; also sheet 1
AMIGA_D3: IC5.15(B4) IC11.14(B5) ; also sheet 1
AMIGA_D4: IC5.14(B5) IC11.15(B4) ; also sheet 1
AMIGA_D5: IC5.13(B6) IC11.18(B1) ; also sheet 1
AMIGA_D6: IC5.12(B7) IC11.17(B2) ; also sheet 1
AMIGA_D7: IC5.11(B8) IC11.16(B3) ; also sheet 1
AMIGA_D8: IC6.18(B1) IC10.18(B1) ; also sheet 1
AMIGA_D9: IC6.17(B2) IC10.17(B2) ; also sheet 1
AMIGA_D10: IC6.16(B3) IC10.16(B3) ; also sheet 1
AMIGA_D11: IC6.15(B4) IC10.15(B4) ; also sheet 1
AMIGA_D12: IC6.14(B5) IC10.14(B5) ; also sheet 1
AMIGA_D13: IC6.13(B6) IC10.13(B6) ; also sheet 1
AMIGA_D14: IC6.12(B7) IC10.12(B7) ; also sheet 1
AMIGA_D15: IC6.11(B8) IC10.11(B8) ; also sheet 1
AMIGA_DATA_DIR: IC5.1(DIR) IC6.1(DIR) IC10.1(DIR) IC11.1(DIR) ; also sheet 2
BGACK_00: IC4.1(DIR) IC8.1(DIR) IC9.1(DIR) ; also sheet 1,2
D0: IC5.2(A1) ; also sheet 1,2
D1: IC5.3(A2) ; also sheet 1,2
D2: IC5.4(A3) ; also sheet 1,2
D3: IC5.5(A4) ; also sheet 1,2
D4: IC5.6(A5) ; also sheet 1,2
D5: IC5.7(A6) ; also sheet 1,2
D6: IC5.8(A7) ; also sheet 1,2
D7: IC5.9(A8) ; also sheet 1,2
D8: IC6.2(A1) ; also sheet 1,2
D9: IC6.3(A2) ; also sheet 1,2
D10: IC6.4(A3) ; also sheet 1,2
D11: IC6.5(A4) ; also sheet 1,2
D12: IC6.6(A5) ; also sheet 1,2
D13: IC6.7(A6) ; also sheet 1,2
D14: IC6.8(A7) ; also sheet 1,2
D15: IC6.9(A8) ; also sheet 1,2
D16: IC11.9(A8) ; also sheet 1,2
D17: IC11.8(A7) ; also sheet 1,2
D18: IC11.7(A6) ; also sheet 1,2
D19: IC11.6(A5) ; also sheet 1,2
D20: IC11.5(A4) ; also sheet 1,2
D21: IC11.2(A1) ; also sheet 1,2
D22: IC11.3(A2) ; also sheet 1,2
D23: IC11.4(A3) ; also sheet 1,2
D24: IC10.2(A1) ; also sheet 1,2
D25: IC10.3(A2) ; also sheet 1,2
D26: IC10.4(A3) ; also sheet 1,2
D27: IC10.5(A4) ; also sheet 1,2
D28: IC10.6(A5) ; also sheet 1,2
D29: IC10.7(A6) ; also sheet 1,2
D30: IC10.8(A7) ; also sheet 1,2
D31: IC10.9(A8) ; also sheet 1,2
GND: C16.2 C17.2 C24.2 C25.2 C26.2 C27.2 C28.2 IC4.10(GND) IC5.10(GND) IC6.10(GND) IC8.10(GND) IC9.10(GND) IC10.10(GND) IC11.10(GND) RN1.5 RN1.6 RN1.7 RN1.8 RN2.5 RN2.6 RN2.7 RN2.8 RN3.5 RN3.6 RN3.7 RN3.8 RN4.5 RN4.6 RN4.7 RN4.8 RN5.5 RN5.6 RN5.7 RN5.8 RN6.5 RN6.6 RN6.7 RN6.8 RN7.5 RN7.6 RN7.7 RN7.8 RN8.5 RN8.6 RN8.7 RN8.8 ; also sheet 1,2
N$3: IC9.18(B1) R26.1
N$4: IC9.2(A1) R27.2
VCC: C16.1 C17.1 C24.1 C25.1 C26.1 C27.1 C28.1 IC4.20(VCC) IC5.20(VCC) IC6.20(VCC) IC8.20(VCC) IC9.20(VCC) IC10.20(VCC) IC11.20(VCC) R26.2 R27.1 ; also sheet 1,2

### Buses
A[0..31]
AMIGA_A[1..23]
AMIGA_D[0..15]
D[0..31]

## Library data of the parts
C1-C19 C21-C28 = rcl:C-EU: CAPACITOR, European symbol
IC1 = micro-mc68000:MC68030RC: 68xxx PROCESSOR; MF: MOTOROLA; MPN: MC68030RC50C; OC_FARNELL: unknown; OC_NEWARK: 52F3269
IC2 = micro-mc68000:MC68000P: 68xxx PROCESSOR; OC_FARNELL: unknown; OC_NEWARK: unknown
IC3 = micro-mc68000:MC68881FN: 68xxx PROCESSOR; OC_FARNELL: unknown; OC_NEWARK: unknown
IC4-IC6 IC8-IC11 = 74xx-eu:74*245: Octal BUS TRANSCEIVER, 3-state
IC7 = amd-mach-Small-pad:M4-128T100: AMD MACH SERIES; OC_FARNELL: unknown; OC_NEWARK: unknown
IC12 = SMD-Crystal:CSX-750FC: CITIZEN Crystal Clock Oscilator from http://cfm.citizen.co.jp/english/product/pdf/CSX-750F.pdf
L1 R1-R27 = rcl:R-EU_: RESISTOR, European symbol
QG1 = crystal:QG5860: CRYSTAL RESONATOR; OC_FARNELL: unknown; OC_NEWARK: unknown
RN1-RN8 = resistor-dil:4R-N: Array Chip Resistor Source: RS Component / Phycomp; OC_FARNELL: unknown; OC_NEWARK: unknown
SV1 = con-harting-ml:ML10: HARTING; OC_FARNELL: unknown; OC_NEWARK: unknown
X1 = con-vg:FABC96R: CONNECTOR female, 96 pins, type R, rows ABC, grid 2.54 mm